# Altium project PCB_Project1 - Copy (2).PrjPCB
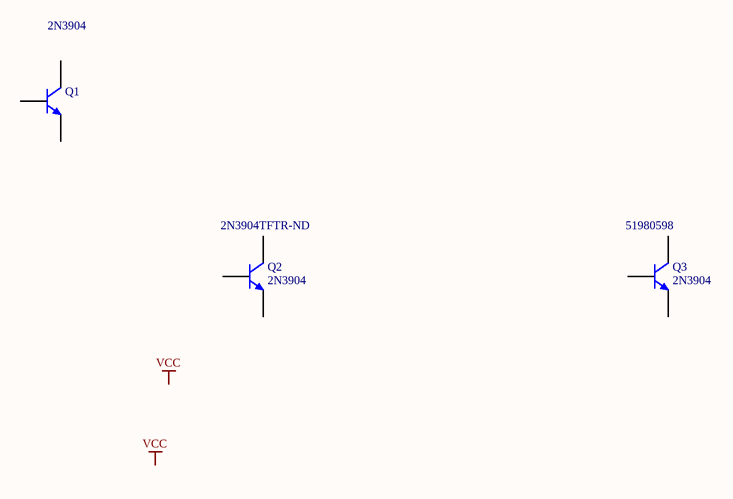
[diagram p0: Sheet1.SchDoc]
1 sheet, 3 parts. Net scope: global (net labels, ports and power ports of the same name join across sheets).
Board files: PCB2.PcbDoc, PCB1.PcbDoc

## Sheet Sheet1.SchDoc
size A4

### Parts
Q1  2N3904  [TO-92A]
Q2  2N3904  Supplier Part Number 1: 2N3904TFTR-ND  [TO-92A]
Q3  2N3904  Supplier Part Number 1: 51980598  [TO-92A]

### Nets

Not connected (* = marked no-connect by the designer): Q1 1(E) 2(B) 3(C); Q2 1(E) 2(B) 3(C); Q3 1(E) 2(B) 3(C)

### Notes on the sheet
- Labels drawn without touching a wire or pin: VCC

### Library data of the parts
Q1 = 2N3904: NPN General Purpose Amplifier; Published: 8-Jun-2000; LatestRevisionDate: 15-Jan-2003; LatestRevisionNote: PCB Footprint 'BCY-W3/D4.7' replaced; DatasheetVersion: 1997; PackageVersion: Sep-1998; PackageReference: TO-92A; Publisher: Altium Limited; PackageDescription: TO, Flat Index; 3 In-Line, Axial Leads; Body Dia. 4.5mm; Leads 0.51 x 0.48 mm (max); ComponentLink1Description: Manufacturer Link; ComponentLink1URL: http://www.fairchildsemi.com/; ComponentLink2Description: Datasheet; ComponentLink2URL: http://www.fairchildsemi.com/ds/2N%2F2N3904.pdf
Q2 = 2N3904: NPN General Purpose Amplifier; Manufacturer: Fairchild Semiconductor; Manufacturer Part Number: 2N3904TF; Description: TRANSISTOR NPN 40V 200MA TO-92; Current - Collector (Ic) (Max): 200mA; Voltage - Collector Emitter Breakdown (Max): 40V; Vce Saturation (Max) @ Ib, Ic: 300mV @ 5mA, 50mA; DC Current Gain (hFE) (Min) @ Ic, Vce: 100 @ 10mA, 1V; Power - Max: 625mW; Frequency - Transition: 300MHz; Published: 8-Jun-2000; LatestRevisionDate: 15-Jan-2003; LatestRevisionNote: PCB Footprint 'BCY-W3/D4.7' replaced; DatasheetVersion: 1997; PackageVersion: Sep-1998; PackageReference: TO-92A; Publisher: Altium Limited; PackageDescription: TO, Flat Index; 3 In-Line, Axial Leads; Body Dia. 4.5mm; Leads 0.51 x 0.48 mm (max); ComponentLink1Description: Manufacturer Link; ComponentLink1URL: http://www.fairchildsemi.com/; ComponentLink2Description: Datasheet; ComponentLink2URL: http://www.fairchildsemi.com/ds/2N%2F2N3904.pdf; Supplier 1: Digi-Key; RoHS: RoHS Compliant; Category: Discrete Semiconductor Products; Stock 1: 60000; Pricing 1: 2000=0.03482, 6000=0.0314, 10000=0.02731, 50000=0.02184, 100000=0.02048, 200000=0.01816 (AUD); Transistor Type: NPN; Current - Collector Cutoff (Max): -; Mounting Type: Through Hole; Package / Case: TO-226-3, TO-92-3 (TO-226AA) Formed Leads; Supplier Device Package: TO-92-3; Packaging: Tape & Reel (TR); ComponentLink3URL: http://www.fairchildsemi.com/ds/MM/MMBT3904.pdf; ComponentLink3Description: http://www.fairchildsemi.com/ds/MM/MMBT3904.pdf
Q3 = 2N3904: NPN General Purpose Amplifier; Manufacturer: Central Semiconductor; Description: Trans GP BJT NPN 40V 0.2A 3-Pin TO-92 Box; Lead Time: 0 weeks; Published: 8-Jun-2000; LatestRevisionDate: 15-Jan-2003; LatestRevisionNote: PCB Footprint 'BCY-W3/D4.7' replaced; DatasheetVersion: 1997; PackageVersion: Sep-1998; PackageReference: TO-92A; Publisher: Altium Limited; PackageDescription: TO, Flat Index; 3 In-Line, Axial Leads; Body Dia. 4.5mm; Leads 0.51 x 0.48 mm (max); ComponentLink1Description: Manufacturer Link; ComponentLink1URL: http://www.fairchildsemi.com/; ComponentLink2Description: Datasheet; ComponentLink2URL: http://www.fairchildsemi.com/ds/2N%2F2N3904.pdf; Supplier 1: Arrow; Manufacturer Part Number: 2N3904; RoHS: CHINA ROHS: Not Compliant / EU ROHS: Not Compliant; Stock 1: 0; EU_ROHS_PROD_EXEMPTION_BY_SUPP: N/R; ComponentLink3URL: http://components.arrow.com/partservice/dataview/altium/51980598?apiKey=aa438727d59eed98c4bed826d8d949c84cb5e685b92bf87346a0226bd2658797; ComponentLink3Description: http://components.arrow.com/partservice/dataview/altium/51980598?apiKey=aa438727d59eed98c4bed826d8d949c84cb5e685b92bf87346a0226bd2658797